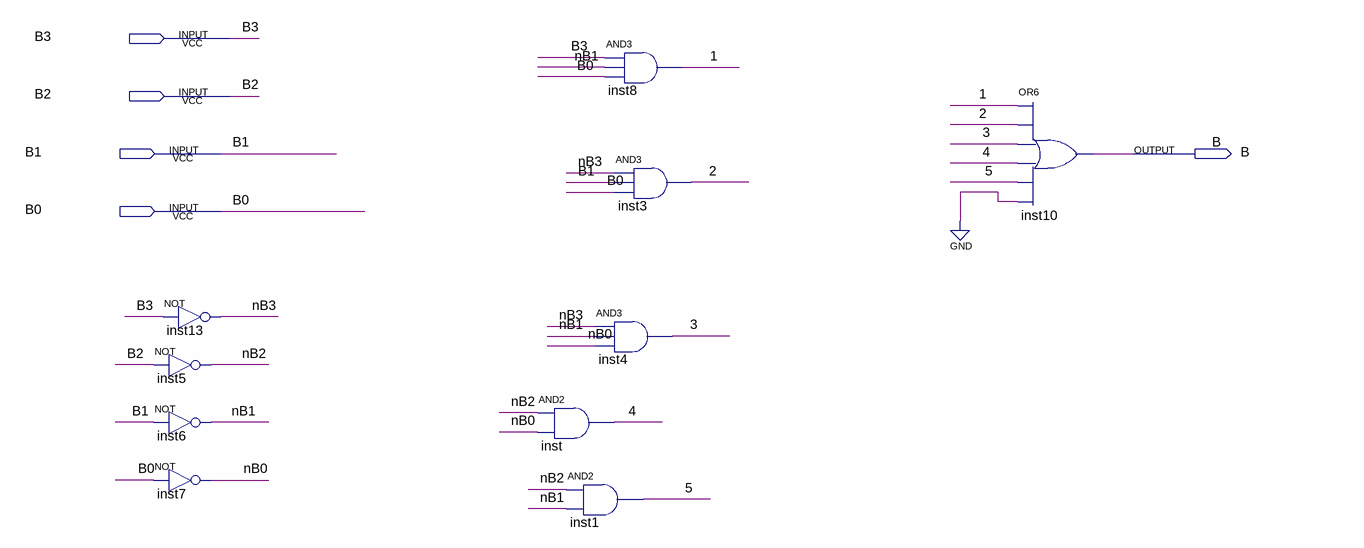
[diagram p0: schematic sheet]
// Quartus schematic B.bdf as structural Verilog: 10 symbols, 5 pins
module B (
  input  B3,
  input  B2,
  input  B1,
  input  B0,
  output B
);

  wire \1 , \2 , \3 , \4 , \5 , nB0, nB1, nB2, nB3;

  not inst13 (nB3, B3);
  not inst5 (nB2, B2);
  not inst6 (nB1, B1);
  not inst7 (nB0, B0);
  and inst (\4 , nB2, nB0);
  and inst8 (\1 , B3, nB1, B0);
  and inst3 (\2 , nB3, B1, B0);
  and inst4 (\3 , nB3, nB1, nB0);
  and inst1 (\5 , nB2, nB1);
  or inst10 (B, \1 , \2 , \3 , \4 , \5 , 1'b0);
endmodule
